# EAGLE design gacun (EAGLE 8.6.0)
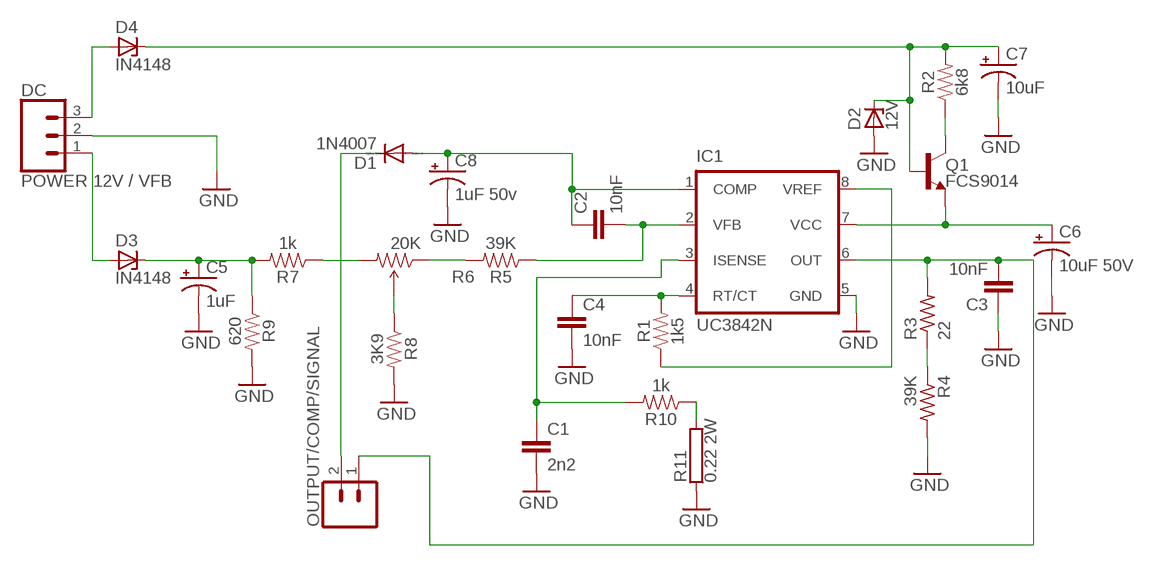
[diagram p0: schematic, sheet 1]

## Parts
C1  2n2  10NF-PTH-10MM-10000V-1-%  [CAP-PTH-10MM]
C2  10nF  10NF-PTH-10MM-10000V-1-%  [CAP-PTH-10MM]
C3  10nF  10NF-PTH-10MM-10000V-1-%  [CAP-PTH-10MM]
C4  10nF  10NF-PTH-10MM-10000V-1-%  [CAP-PTH-10MM]
C5  1uF  10UF-POLAR-RADIAL-2.5MM-25V-20%  [CPOL-RADIAL-2.5MM-5MM]
C6  10uF 50V  CPOL-USE2-4  [E2-4]
C7  10uF  10UF-POLAR-RADIAL-2.5MM-25V-20%  [CPOL-RADIAL-2.5MM-5MM]
C8  1uF 50v  10UF-POLAR-RADIAL-2.5MM-25V-20%  [CPOL-RADIAL-2.5MM-5MM]
D1  1N4007  1N4004  [DO41-10]
D2  12V  ZENER-DIODEZD-7.5  [ZDIO-7.5]
D3  IN4148  ZENER-DIODEZD-7.5  [ZDIO-7.5]
D4  IN4148  ZENER-DIODEZD-7.5  [ZDIO-7.5]
DC  POWER 12V / VFB  CONN_03  [1X03]
IC1  UC3842N  [DIL08]
OUTPUT/COMP/SIGNAL  CONN_02  [1X02]
Q1  FCS9014  TRANS_NPN-2N3904-EZ  [TO-92-EZ]
R1  1k5  1KOHM-HORIZ-1/4W-1%  [AXIAL-0.3]
R2  6k8  1KOHM-HORIZ-1/4W-1%  [AXIAL-0.3]
R3  22  R-US_0204/7  [0204/7]
R4  39K  R-US_0204/7  [0204/7]
R5  39K  1KOHM-HORIZ-1/4W-1%  [AXIAL-0.3]
R6  20K  TRIMPOTPTH  [TRIM_POT_PTH]
R7  1k  1KOHM-HORIZ-1/4W-1%  [AXIAL-0.3]
R8  3K9  1KOHM-HORIZ-1/4W-1%  [AXIAL-0.3]
R9  620  1KOHM-HORIZ-1/4W-1%  [AXIAL-0.3]
R10  1k  1KOHM-HORIZ-1/4W-1%  [AXIAL-0.3]
R11  0.22 2W  RKH206-8  [KH206-8]

## Nets
GND: C1.2 C3.1 C4.2 C5.2(-) C6.- C7.2(-) C8.2(-) D2.A DC.2 IC1.5(GND) R4.2 R8.P$2 R9.P$2 R11.1
N$1: C2.1 C8.1(+) D1.A IC1.1(COMP)
N$2: C2.2 IC1.2(VFB) R5.P$1
N$3: C4.1 IC1.4(RT/CT) R1.P$2
N$4: C3.2 IC1.6(OUT) OUTPUT/COMP/SIGNAL.1 R3.2
N$5: C6.+ IC1.7(VCC) Q1.1(E)
N$6: Q1.3(C) R2.P$1
N$7: C7.1(+) D2.C D4.C Q1.2(B) R2.P$2
N$8: R3.1 R4.1
N$9: IC1.8(VREF) R1.P$1
N$10: R5.P$2 R6.1(CCW)
N$11: R6.3(CW) R7.P$1
N$12: R6.2(WIPER) R8.P$1
N$13: C5.1(+) D3.C R7.P$2 R9.P$1
N$14: D1.C OUTPUT/COMP/SIGNAL.2
N$15: C1.1 IC1.3(ISENSE) R10.P$2
N$16: D3.A DC.1
N$17: D4.A DC.3
N$19: R10.P$1 R11.2

## Library data of the parts
C1 = SparkFun-Capacitors:10NF: 0.01uF/10nF/10,000pF ceramic capacitors A capacitor is a passive two-terminal electrical component used to store electrical energy temporarily in an electric field. CAP-09321; PROD_ID: CAP-09321; VALUE: 10nF
C2-C4 = SparkFun-Capacitors:10NF: 0.01uF/10nF/10,000pF ceramic capacitors A capacitor is a passive two-terminal electrical component used to store electrical energy temporarily in an electric field. CAP-09321; PROD_ID: CAP-09321
C5 C8 = SparkFun-Capacitors:10UF-POLAR: 10.0µF polarized capacitors A capacitor is a passive two-terminal electrical component used to store electrical energy temporarily in an electric field.; PROD_ID: CAP-08440; VALUE: 10uF
C6 = rcl:CPOL-US: POLARIZED CAPACITOR, American symbol; SPICEPREFIX: C
C7 = SparkFun-Capacitors:10UF-POLAR: 10.0µF polarized capacitors A capacitor is a passive two-terminal electrical component used to store electrical energy temporarily in an electric field.; PROD_ID: CAP-08440
D1 = diode:1N4004: DIODE general purpose rectifier, 1 A
D2-D4 = diode:ZENER-DIODE: Z-Diode
DC = SparkFun-Connectors:CONN_03: Multi connection point. Often used as Generic Header-pin footprint for 0.1 inch spaced/style header connections On any of the 0.1 inch spaced packages, you can populate with these: Break Away Headers - Straight <https://www.sparkfun.com/products/116> (PRT-00116) Break Away Male Headers - Right Angle <https://www.sparkfun.com/products/553> (PRT-00553) Female Headers <https://www.sparkfun.com/products/115> (PRT-00115) Break Away Headers - Machine Pin <https://www.sparkfun.com/products/117> (PRT-00117) Break Away Female Headers - Swiss Machine Pin <https://www.sparkfun.com/products/743> (PRT-00743) Stackable Header - 3 Pin (Female, 0.1") <https://www.sparkfun.com/products/13875> (PRT-13875) For SCREWTERMINALS and SPRING TERMINALS visit here: Screw Terimnals on SparkFun.com <https://www.sparkfun.com/search/results?term=Screw+Terminals> (5mm/3.5mm/2.54mm spacing) This device is also useful as a general connection point to wire up your design to another part of your project. Our various solder wires solder well into these plated through hole pads. Hook-Up Wire - Assortment (Stranded, 22 AWG) <https://www.sparkfun.com/products/11375> (PRT-11375) Hook-Up Wire - Assortment (Solid Core, 22 AWG) <https://www.sparkfun.com/products/11367> (PRT-11367) View the entire wire category on our website here <https://www.sparkfun.com/categories/141> Special notes: Molex polarized connector foot print use with SKU : PRT-08232 with associated crimp pins and housings.; PROD_ID: XXX-00000; VALUE: 455-1750-1-ND
IC1 = v-reg:UC384*: SMPS Controller Source: http://www.fairchildsemi.com/ds/UC/UC3843.pdf
OUTPUT/COMP/SIGNAL = SparkFun-Connectors:CONN_02: Multi connection point. Often used as Generic Header-pin footprint for 0.1 inch spaced/style header connections On any of the 0.1 inch spaced packages, you can populate with these: Break Away Headers - Straight <https://www.sparkfun.com/products/116> (PRT-00116) Break Away Male Headers - Right Angle <https://www.sparkfun.com/products/553> (PRT-00553) Female Headers <https://www.sparkfun.com/products/115> (PRT-00115) Break Away Headers - Machine Pin <https://www.sparkfun.com/products/117> (PRT-00117) Break Away Female Headers - Swiss Machine Pin <https://www.sparkfun.com/products/743> (PRT-00743) For SCREWTERMINALS and SPRING TERMINALS visit here: Screw Terimnals on SparkFun.com <https://www.sparkfun.com/search/results?term=Screw+Terminals> (5mm/3.5mm/2.54mm spacing) This device is also useful as a general connection point to wire up your design to another part of your project. Our various solder wires solder well into these plated through hole pads. Hook-Up Wire - Assortment (Stranded, 22 AWG) <https://www.sparkfun.com/products/11375> (PRT-11375) Hook-Up Wire - Assortment (Solid Core, 22 AWG) <https://www.sparkfun.com/products/11367> (PRT-11367) View the entire wire category on our website here <https://www.sparkfun.com/categories/141> Special notes: Molex polarized connector foot print use with: PRT-08233 with associated crimp pins and housings. 2.54_SCREWTERM for use with PRT-10571. 3.5mm Screw Terminal footprints for PRT-08084 5mm Screw Terminal footprints for use with PRT-08432
Q1 = SparkFun-DiscreteSemi:TRANS_NPN: NPN transistor Current controlled devices typically used to amplify current or used as a switch. BC547 - COM-08928 <http://www.sparkfun.com/products/8928> (TO-92 45V 100mA) (1.Collector 2.Base 3.Emitter) 2N3904 - COM-00521 <http://www.sparkfun.com/products/521> (TO-92 40V 200mA) (1.Emitter 2.Base 3.Collector) P2N2222A - COM-12852 <http://www.sparkfun.com/products/12852> (TO-92 40V 600mA) (1.Collector 2.Base 3.Emitter); PROD_ID: TRANS-08447; VALUE: 200mA/40V
R1 R2 R5 R8 R9 = SparkFun-Resistors:1KOHM: 1kΩ resistor A resistor is a passive two-terminal electrical component that implements electrical resistance as a circuit element. Resistors act to reduce current flow, and, at the same time, act to lower voltage levels within circuits. - Wikipedia; PROD_ID: RES-12182; VALUE: 1k
R3 R4 = resistor:R-US_: RESISTOR, American symbol
R6 = SparkFun-Retired:TRIMPOT: Various small potentiometers for "set-and-forget" applications; PROD_ID: RES-08445
R7 R10 = SparkFun-Resistors:1KOHM: 1kΩ resistor A resistor is a passive two-terminal electrical component that implements electrical resistance as a circuit element. Resistors act to reduce current flow, and, at the same time, act to lower voltage levels within circuits. - Wikipedia; PROD_ID: RES-12182
R11 = resistor-power:R: Power Resitor; OC_FARNELL: unknown; OC_NEWARK: unknown

## Board
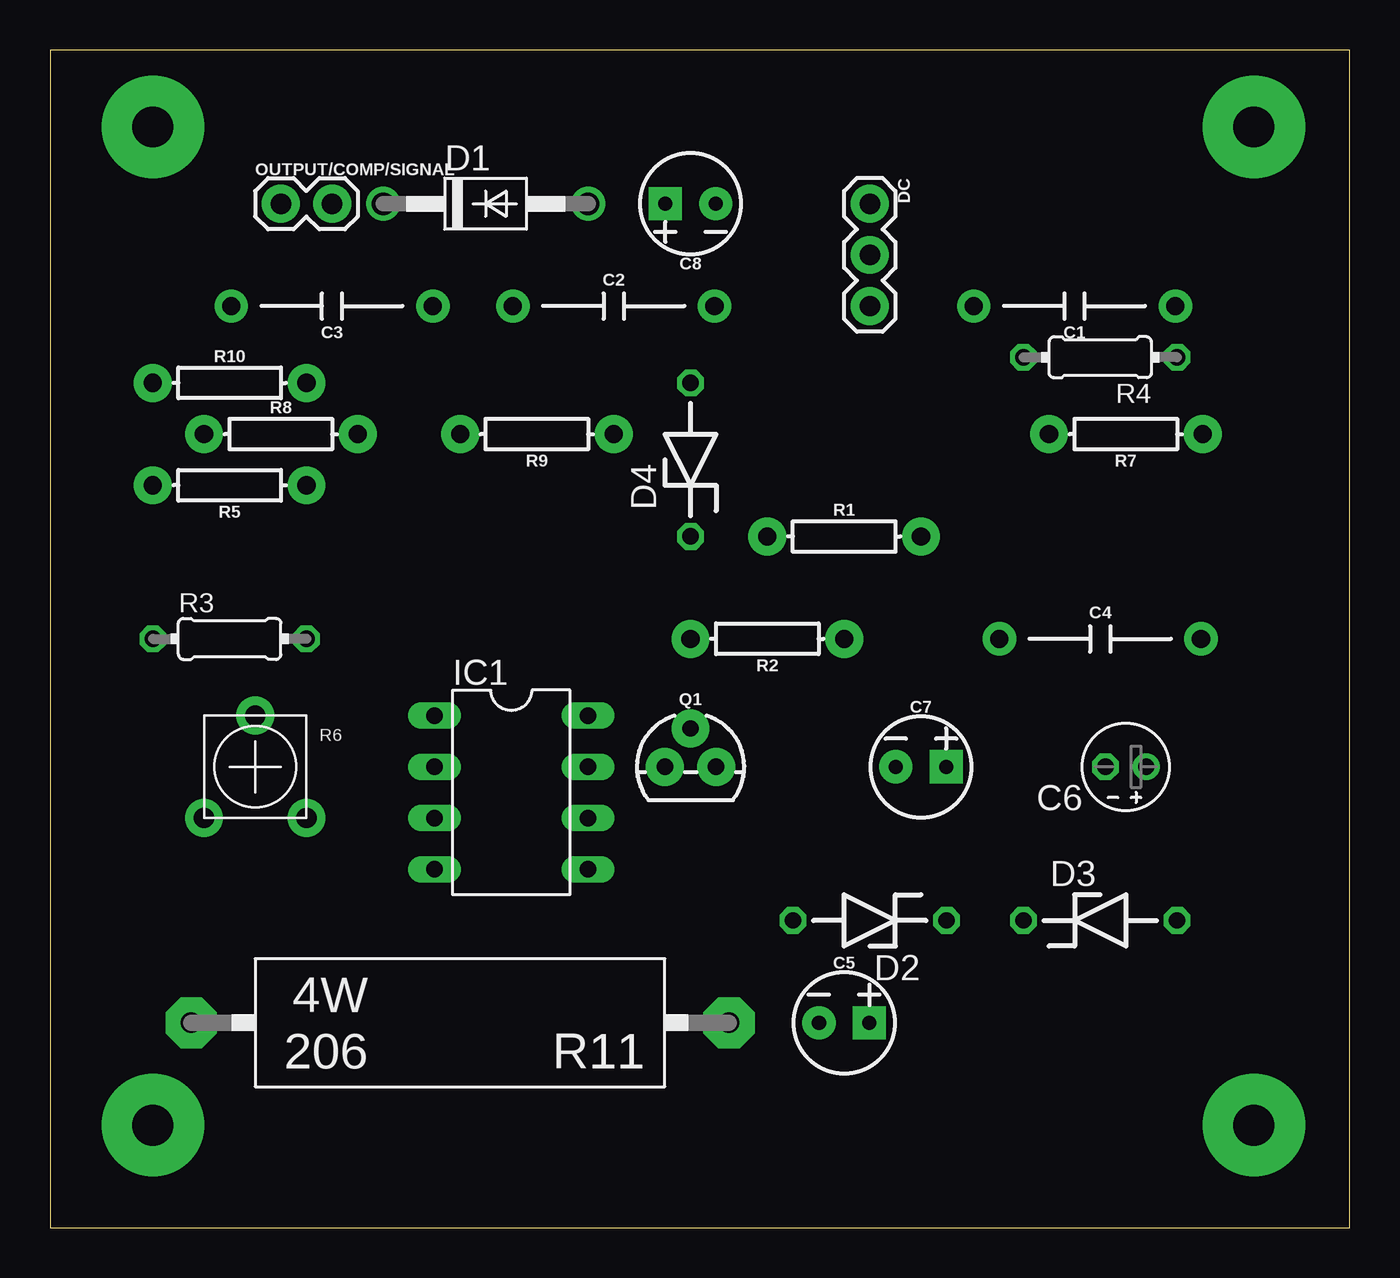
[diagram p1: board, top side]
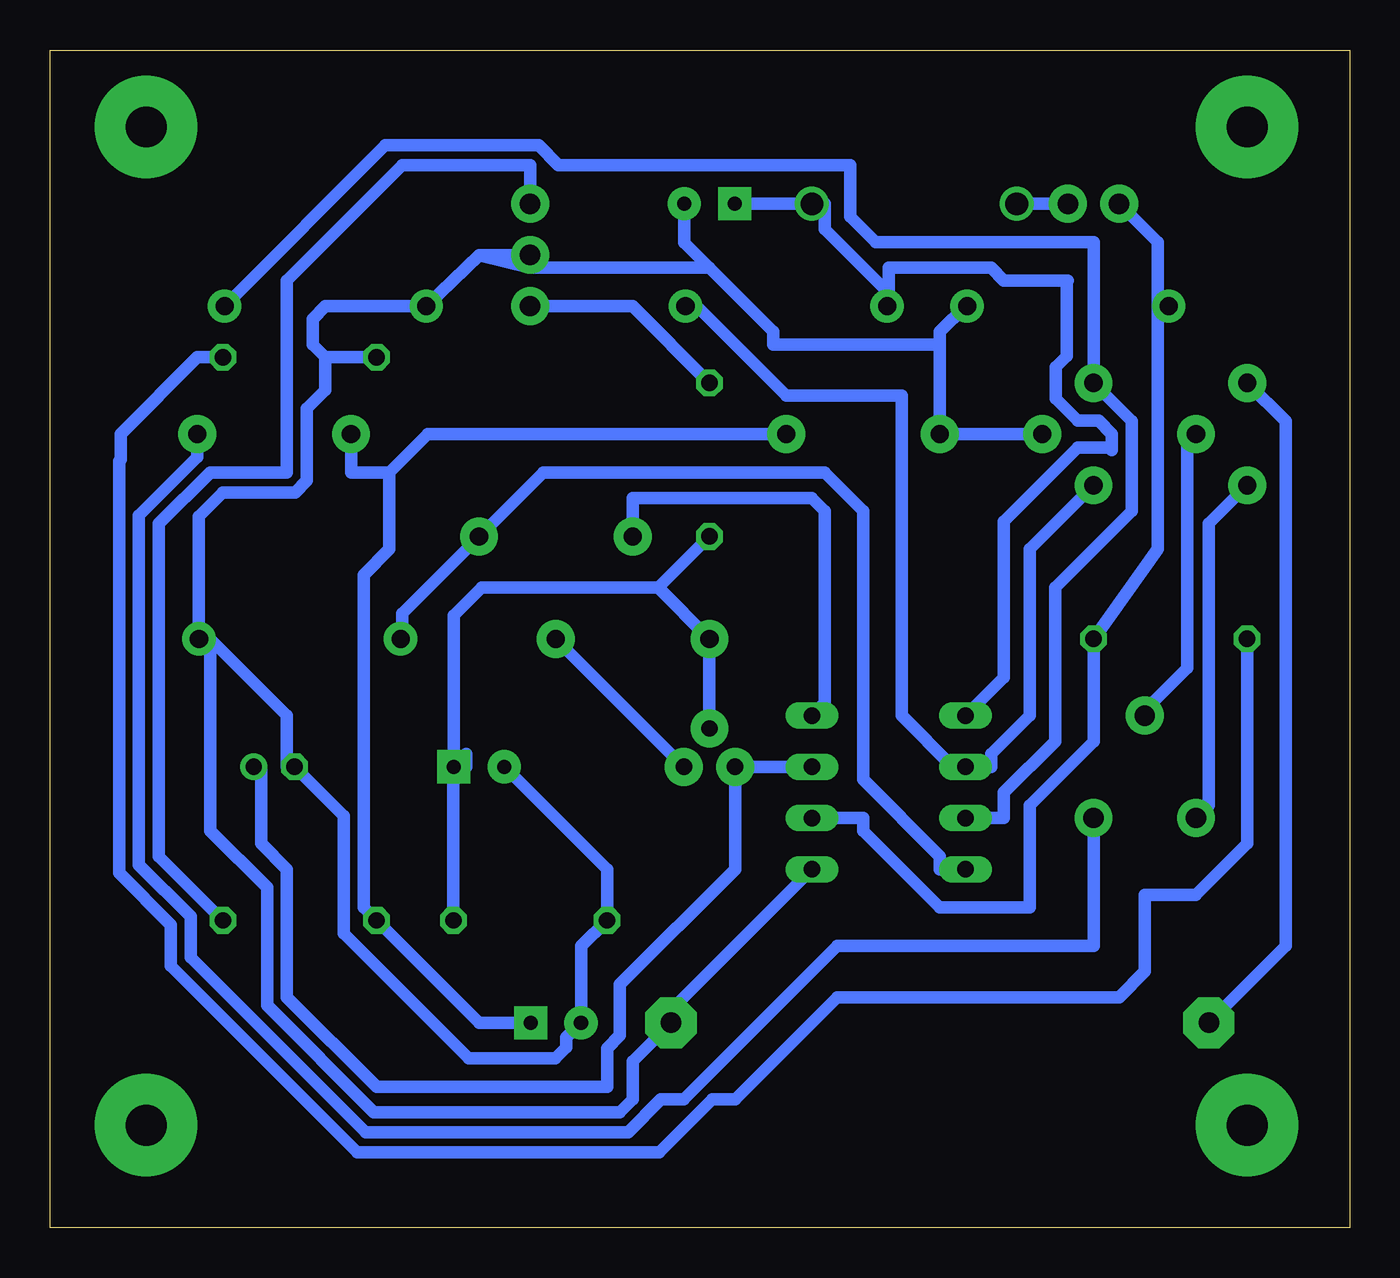
[diagram p2: board, bottom side, seen from below]

Size 64.44 x 58.41 mm. Coordinates in mm from the lower left corner, seen from the top.
Outline: 0,0 64.44,0 64.44,58.41 0,58.41 0,0
Copper layers (1*16): Top 0.035mm / dielectric 1.5mm / Bottom 0.035mm
Design rules "default *": minimum track width 24mil, minimum drill 0.35mm, track to track 15mil, track to pad 25mil, pad to pad 6mil, via to via 6mil, smd to smd 6mil, copper to edge 40mil, drill to drill 6mil, minimum pad ring 10mil, minimum via ring 8mil, stop-mask expansion 4mil, vias tented up to drill 0mil, thermal gap 10mil

### Footprints (pad centres in the part's own frame; a part is rotated, then mirrored left to right if it is on the bottom)
CAP-PTH-10MM = drill 0.9 pad 1.651: 1 -5,0; 2 5,0
CPOL-RADIAL-2.5MM-5MM = drill 0.7 pad 1.651 square: 1 1.25,0 | drill 0.7 pad 1.651: 2 -1.25,0
E2-4 = drill 0.813 pad 1.27: + -1.016,0 | drill 0.813 pad 1.27 octagon: - 1.016,0
DO41-10 = drill 1.118: A 5.08,0; C -5.08,0
ZDIO-7.5 = drill 0.813 octagon: A 3.81,0; C -3.81,0
1X03 = drill 1.016 pad 1.88: 1 0,0; 2 2.54,0; 3 5.08,0
DIL08 = drill 0.813 long: 1 -3.81,-3.81; 2 -1.27,-3.81; 3 1.27,-3.81; 4 3.81,-3.81; 5 3.81,3.81; 6 1.27,3.81; 7 -1.27,3.81; 8 -3.81,3.81
1X02 = drill 1.016 pad 1.88: 1 0,0; 2 2.54,0
TO-92-EZ = drill 0.813 pad 1.88: 1 -1.27,0; 2 0,1.905; 3 1.27,0
AXIAL-0.3 = drill 0.9 pad 1.88: P$1 -3.81,0; P$2 3.81,0
0204/7 = drill 0.813 octagon: 1 -3.81,0; 2 3.81,0
TRIM_POT_PTH = drill 1 pad 1.88: 1 -2.54,-2.54; 2 0,2.54; 3 2.54,-2.54
KH206-8 = drill 1.016 pad 2.54 octagon: 1 -13.335,0; 2 13.335,0

### Placement (x,y rotation side)
C1  50.8,45.72 180 top
C2  27.94,45.72 0 top
C3  13.97,45.72 180 top
C4  52.07,29.21 0 top
C5  39.37,10.16 0 top
C6  53.34,22.86 180 top
C7  43.18,22.86 0 top
C8  31.75,50.8 180 top
D1  21.59,50.8 0 top
D2  40.64,15.24 180 top
D3  52.07,15.24 0 top
D4  31.75,38.1 90 top
DC  40.64,50.8 270 top
IC1  22.86,21.59 270 top
OUTPUT/COMP/SIGNAL  11.43,50.8 0 top
Q1  31.75,22.86 0 top
R1  39.37,34.29 0 top
R2  35.56,29.21 180 top
R3  8.89,29.21 0 top
R4  52.07,43.18 180 top
R5  8.89,36.83 180 top
R6  10.16,22.86 0 top
R7  53.34,39.37 180 top
R8  11.43,39.37 0 top
R9  24.13,39.37 180 top
R10  8.89,41.91 0 top
R11  20.32,10.16 180 top

### Tracks (layer width: path | path; a pad name or v marks a point on that pad's centre or on a via)
GND
  Bottom 0.61: C7.2 41.91,22.86 36.83,17.78 D2.A 38.1,13.97 38.1,10.16 C5.2 38.85,9.43 38.85,8.95 39.41,8.39 43.68,8.39 49.89,14.6 49.89,20.42 C6.- 52.7,22.86 52.7,25.4 56.52,29.21 | IC1.5 33.66,10.79 R11.1 35.56,8.26 35.56,6.35 36.2,5.71 48.39,5.71 53.7,11.02 53.7,16.87 56.52,19.68 56.52,29.21 | 57.15,29.21 C4.2 | 20.32,43.81 R9.P$2 R8.P$2 | 20.32,43.81 20.32,44.45 19.05,45.72 C3.1 | 43.18,48.26 C1.2 50.8,45.72 51.44,45.09 51.44,43.81 50.8,43.18 | DC.2 43.18,48.26 | 43.18,48.26 40.64,47.62 31.75,47.62 | 20.32,43.81 28.57,43.81 28.57,44.45 31.75,47.62 | 56.52,29.21 C4.2 | C8.2 33,48.88 31.75,47.62 | R4.2 50.8,43.18 | C4.2 57.07,35.28 55.88,36.47 52.3,36.47 51.71,37.05 51.71,40.64 50.8,41.55 50.8,43.18
N$1
  Bottom 0.61: IC1.1 17.14,27.3 17.14,35.04 13.48,38.71 11.92,38.71 11.79,38.57 11.79,39.37 12.45,40.03 13.48,40.03 14.58,41.13 14.58,42.69 14.03,43.24 14.03,46.99 | 22.86,46.35 22.86,45.72 C2.1 22.86,46.35 | 22.86,46.35 22.86,47.62 17.78,47.62 17.14,46.99 14.03,46.99 | 22.86,46.35 26.04,49.53 26.04,50.8 D1.A C8.1 | 14.03,46.99 13.97,46.99
N$2
  Bottom 0.61: R5.P$1 15.88,33.66 15.88,25.4 17.78,23.5 17.78,22.86 IC1.2 19.68,22.86 22.23,25.4 22.23,41.27 27.94,41.27 32.38,45.72 C2.2
N$3
  Bottom 0.61: IC1.4 20.32,17.78 20.32,18.41 24.13,22.23 24.13,35.56 26.04,37.47 40.01,37.47 R1.P$2 46.99,30.48 46.99,29.21 C4.1
N$4
  Bottom 0.61: 9.53,45.72 9.53,33.66 R3.2 12.7,24.13 15.88,20.95 15.88,15.88 20.32,15.88 24.13,19.68 24.13,20.32 IC1.6 | OUTPUT/COMP/SIGNAL.1 9.53,48.9 9.53,45.72 | 9.53,45.72 C3.2
N$5
  Bottom 0.61: IC1.7 Q1.1 30.48,17.78 36.2,12.06 36.2,9.53 36.83,8.89 36.83,6.99 48.26,6.99 52.7,11.43 52.7,17.78 53.98,19.05 53.98,22.86 C6.+
N$6
  Bottom 0.61: Q1.3 R2.P$1
N$7
  Bottom 0.61: D2.C 44.45,22.86 C7.1 | 43.81,23.5 43.81,22.86 C7.1 | D4.C 34.29,31.75 | 34.29,31.75 43.05,31.75 44.43,30.37 C7.1 | Q1.2 R2.P$2 34.29,31.75
N$8
  Bottom 0.61: R3.1 5.08,19.05 7.62,16.51 10.16,16.51 10.16,12.7 11.43,11.43 25.4,11.43 30.48,6.35 31.62,6.35 34.23,3.73 49.21,3.73 58.47,12.99 58.47,15.03 61.04,17.59 61.04,38.02 60.96,38.1 60.96,39.37 57.15,43.18 R4.1
N$9
  Bottom 0.61: IC1.8 26.04,26.04 26.04,35.56 26.67,36.2 35.56,36.2 R1.P$1
N$10
  Bottom 0.61: R6.1 6.99,20.95 6.99,34.92 R5.P$2
N$11
  Bottom 0.61: R6.3 12.7,13.97 25.4,13.97 33.02,6.35 34.16,6.35 35.78,4.72 48.8,4.72 57.48,13.4 57.48,15.44 60.05,18 60.05,35.34 57.15,38.23 R7.P$1
N$12
  Bottom 0.61: R6.2 10.05,25.78 8.06,27.76 8.06,38.92 R8.P$1
N$13
  Bottom 0.61: C5.1 43.18,10.16 D3.C 48.9,15.88 48.9,32.38 47.62,33.66 47.62,37.47 | 47.62,37.47 49.53,37.47 R7.P$2 | R9.P$1 45.72,39.37 47.62,37.47
N$14
  Bottom 0.61: OUTPUT/COMP/SIGNAL.2 D1.C
N$15
  Bottom 0.61: IC1.3 17.14,20.32 17.14,21.59 14.61,24.13 14.61,31.75 10.79,35.56 10.79,40.01 R10.P$2 12.7,48.9 23.5,48.9 24.77,50.16 24.77,52.7 39.24,52.7 40.23,53.7 47.82,53.7 C1.1
N$16
  Bottom 0.61: D3.A 59.05,18.41 59.05,34.92 56.52,37.47 52.7,37.47 52.7,46.99 46.99,52.7 40.64,52.7 DC.1
N$17
  Bottom 0.61: D4.A 35.56,45.72 DC.3
N$19
  Bottom 0.61: R10.P$1 3.17,40.01 3.17,13.97 R11.2
N$24  (via drill 2.03 pad 5.08)
  other vias: 5.08,54.61
N$25  (via drill 2.03 pad 5.08)
  other vias: 59.69,54.61
N$26  (via drill 2.03 pad 5.08)
  other vias: 5.08,5.08
N$27  (via drill 2.03 pad 5.08)
  other vias: 59.69,5.08